# Altium project Ctrl_FOC.PrjPcb
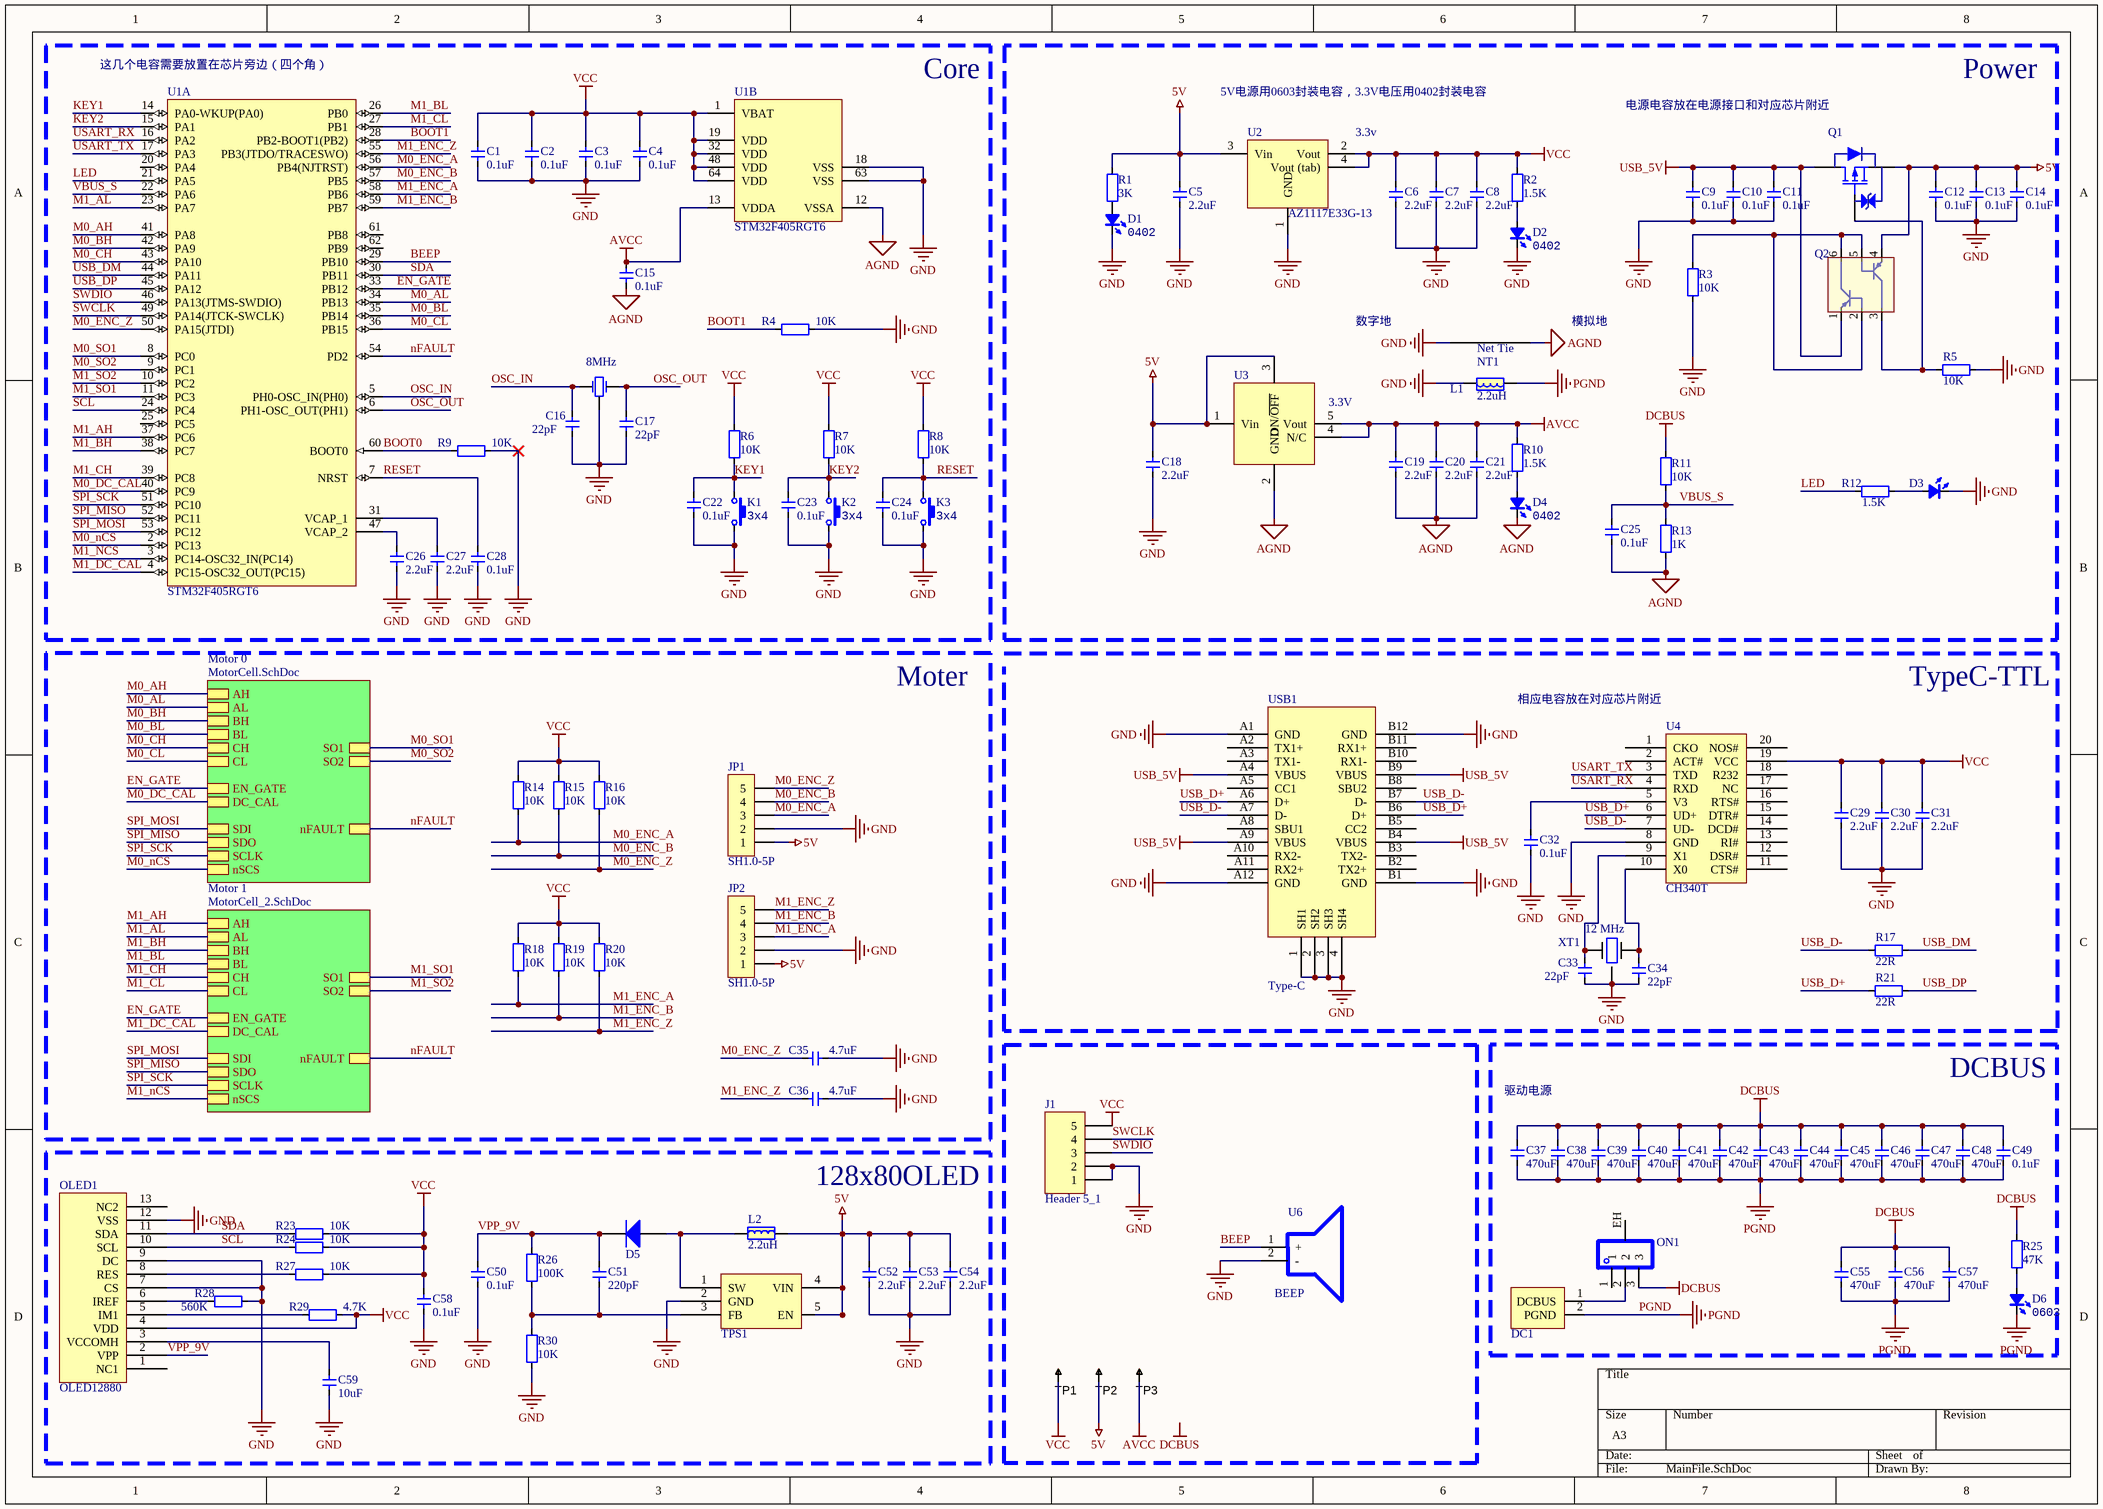
[diagram p0: MainFile.SchDoc]
3 sheets, 209 parts. Net scope: hierarchical (ports join the sheet entries above them; power ports are global).
Board file: Ctrl_FOC.PcbDoc
Sheets:
  MainFile.SchDoc
    Motor 0 = MotorCell.SchDoc
    Motor 1 = MotorCell_2.SchDoc

## Sheet MainFile.SchDoc
size A3

### Parts
C1  0.1uF  [CAP_0402]
C2  0.1uF  [CAP_0402]
C3  0.1uF  [CAP_0402]
C4  0.1uF  [CAP_0402]
C5  2.2uF  [CAP_0603]
C6  2.2uF  [CAP_0402]
C7  2.2uF  [CAP_0402]
C8  2.2uF  [CAP_0402]
C9  0.1uF  [CAP_0603]
C10  0.1uF  [CAP_0603]
C11  0.1uF  [CAP_0603]
C12  0.1uF  [CAP_0603]
C13  0.1uF  [CAP_0603]
C14  0.1uF  [CAP_0603]
C15  0.1uF  [CAP_0603]
C16  22pF  [CAP_0402]
C17  22pF  [CAP_0402]
C18  2.2uF  [CAP_0603]
C19  2.2uF  [CAP_0402]
C20  2.2uF  [CAP_0402]
C21  2.2uF  [CAP_0402]
C22  0.1uF  [CAP_0402]
C23  0.1uF  [CAP_0402]
C24  0.1uF  [CAP_0402]
C25  0.1uF  [CAP_0603]
C26  2.2uF  [CAP_0402]
C27  2.2uF  [CAP_0402]
C28  0.1uF  [CAP_0402]
C29  2.2uF  [CAP_0603]
C30  2.2uF  [CAP_0603]
C31  2.2uF  [CAP_0603]
C32  0.1uF  [CAP_0402]
C33  22pF  [CAP_0402]
C34  22pF  [CAP_0402]
C35  4.7uF  [CAP_0402]
C36  4.7uF  [CAP_0402]
C37  470uF  [CAP_1206]
C38  470uF  [CAP_1206]
C39  470uF  [CAP_1206]
C40  470uF  [CAP_1206]
C41  470uF  [CAP_1206]
C42  470uF  [CAP_1206]
C43  470uF  [CAP_1206]
C44  470uF  [CAP_1206]
C45  470uF  [CAP_1206]
C46  470uF  [CAP_1206]
C47  470uF  [CAP_1206]
C48  470uF  [CAP_1206]
C49  0.1uF  [CAP_1206]
C50  0.1uF  [CAP_0402]
C51  220pF  [CAP_0402]
C52  2.2uF  [CAP_0603]
C53  2.2uF  [CAP_0603]
C54  2.2uF  [CAP_0603]
C55  470uF  [CAP_1206]
C56  470uF  [CAP_1206]
C57  470uF  [CAP_1206]
C58  0.1uF  [CAP_0402]
C59  10uF  [CAP_0402]
D1  Type: 0402  [LED_0402_BLUE]  (hidden comment: color?)
D2  Type: 0402  [LED_0402_BLUE]  (hidden comment: color?)
D3  color?  [LED_0402_BLUE]  (value not drawn)
D4  Type: 0402  [LED_0402_BLUE]  (hidden comment: color?)
D5  二极管-5819W  [SOD-123]  (value not drawn)
D6  Type: 0603  [LED_0603]  (hidden comment: color?)
DC1  电源  [TX60电源]  (value not drawn)
J1  Header 5_1  [单排弯插针5]
JP1  SH1.0-5P  [SH1.0-5P-L]
JP2  SH1.0-5P  [SH1.0-5P-L]
K1  value 3x4  [按键_3x4x2]  (hidden comment: TACT 2P)
K2  value 3x4  [按键_3x4x2]  (hidden comment: TACT 2P)
K3  value 3x4  [按键_3x4x2]  (hidden comment: TACT 2P)
L1  2.2uH  [2520-L]
L2  2.2uH  [2520-L]
NT1  2mm  [NetTie_2mm]  (value not drawn)  (net tie, no BOM)
OLED1  OLED12880  [OLED12880]
ON1  电源开关  [电源开关]  (value not drawn)
Q1  AO3415A  [SOT23-3]  (value not drawn)
Q2  BCM856BS  [SOT363-6]  (value not drawn)
R1  3K  [RES_0603]
R2  1.5K  [RES_0402]
R3  10K  [RES_0603]
R4  10K  [RES_0402]
R5  10K  [RES_0603]
R6  10K  [RES_0402]
R7  10K  [RES_0402]
R8  10K  [RES_0402]
R9  10K  [RES_0402]
R10  1.5K  [RES_0402]
R11  10K  [RES_0603]
R12  1.5K  [RES_0402]
R13  1K  [RES_0603]
R14  10K  [RES_0603]
R15  10K  [RES_0603]
R16  10K  [RES_0603]
R17  22R  [RES_0603]
R18  10K  [RES_0603]
R19  10K  [RES_0603]
R20  10K  [RES_0603]
R21  22R  [RES_0603]
R23  10K  [RES_0402]
R24  10K  [RES_0402]
R25  47K  [RES_0603]
R26  100K  [RES_0402]
R27  10K  [RES_0402]
R28  560K  [RES_0402]
R29  4.7K  [RES_0402]
R30  10K  [RES_0402]
TP1  TESTPOINT  [TP-R30]  (value not drawn)  (no BOM)
TP2  TESTPOINT  [TP-R30]  (value not drawn)  (no BOM)
TP3  TESTPOINT  [TP-R30]  (value not drawn)  (no BOM)
TPS1  TPS61040DBV  [SOT23-5]  (value not drawn)
U1  STM32F405RGT6  [主控芯片LQFP64-10*10]  (parts A,B of 2)
U2  AZ1117E33G-13  value 3.3v  [SOT223]
U3  3.3V  [SOT23-5]
U4  CH340T  [SSOP-20]
U6  BEEP  [BEEP]
USB1  Type-C  [Type-C-TOP]
X1  8MHz  [XTAL3215]
XT1  value 12 MHz  [DFN220P320X110-4N]  (hidden comment: 8 MHz)

### Blocks framed on the sheet
Core: C1-C4 C15-C17 C22-C24 C26-C28 K1-K3 R4 R6-R9 U1 X1
Power: C5-C14 C18-C21 C25 D1-D4 L1 NT1 Q1 Q2 R1-R3 R5 R10-R13 U2 U3
Moter: C35 C36 JP1 JP2 R14-R16 R18-R20
DCBUS: C37-C49 C55-C57 D6 DC1 ON1 R25
128x80OLED: C50-C54 C58 C59 D5 L2 OLED1 R23 R24 R26-R30 TPS1

### Sub-sheets
Motor 0 = MotorCell.SchDoc: nFAULT, EN_GATE, DC_CAL, SDI, SDO, SCLK, nSCS, SO1, SO2, AH, AL, BH, BL, CH, CL
Motor 1 = MotorCell_2.SchDoc: nFAULT, EN_GATE, DC_CAL, SDI, SDO, SCLK, nSCS, SO1, SO2, AH, AL, BH, BL, CH, CL

### Nets
5V: C5.2 C12.2 C13.2 C14.2 C18.2 C52.2 C53.2 C54.2 JP1.1 JP2.1 L2.2 Q1.2(S) Q2.4 R1.2 TP2.1 TPS1.4(VIN) TPS1.5(EN) U2.3(Vin) U3.1(Vin) U3.3(ON/~{OFF})
AGND: C15.1 C19.1 C20.1 C21.1 C25.1 D4.2(K) NT1.2 R13.1 U1.12(VSSA) U3.2(GND)
AVCC: C15.2 C19.2 C20.2 C21.2 R10.2 TP3.1 U1.13(VDDA) U3.4(N/C) U3.5(Vout)
DCBUS: C37.2 C38.2 C39.2 C40.2 C41.2 C42.2 C43.2 C44.2 C45.2 C46.2 C47.2 C48.2 C49.2 C55.2 C56.2 C57.2 ON1.3 R11.2 R25.2
GND: C1.1 C2.1 C3.1 C4.1 C5.1 C6.1 C7.1 C8.1 C9.1 C10.1 C11.1 C12.1 C13.1 C14.1 C16.1 C17.1 C18.1 C22.1 C23.1 C24.1 C26.1 C27.1 C28.2 C29.1 C30.1 C31.1 C32.1 C33.1 C34.1 C35.1 C36.1 C50.1 C52.1 C53.1 C54.1 C58.1 C59.1 D1.2(K) D2.2(K) D3.2(K) J1.1 J1.2 JP1.2 JP2.2 K1.2 K2.2 K3.2 L1.2 NT1.1 OLED1.7(CS) OLED1.9(DC) OLED1.12(VSS) R3.2 R4.1 R5.1 R9.1 R28.2 R30.1 TPS1.2(GND) U1.18(VSS) U1.63(VSS) U2.1(GND) U4.8(GND) U6.2(-) USB1.1(SH1) USB1.2(SH2) USB1.3(SH3) USB1.4(SH4) USB1.A1(GND) USB1.A12(GND) USB1.B1(GND) USB1.B12(GND) X1.2(GND) XT1.G
PGND: C37.1 C38.1 C39.1 C40.1 C41.1 C42.1 C43.1 C44.1 C45.1 C46.1 C47.1 C48.1 C49.1 C55.1 C56.1 C57.1 D6.2(K) DC1.2(PGND) L1.1
USB_5V: C9.2 C10.2 C11.2 Q1.3(D) Q2.1 USB1.A4(VBUS) USB1.A9(VBUS) USB1.B4(VBUS) USB1.B9(VBUS)
VCC: C1.2 C2.2 C3.2 C4.2 C6.2 C7.2 C8.2 C29.2 C30.2 C31.2 C58.2 J1.5 OLED1.4(VDD) R2.2 R6.1 R7.1 R8.1 R14.2 R15.2 R16.2 R18.2 R19.2 R20.2 R23.2 R24.2 R27.2 R29.2 TP1.1 U1.1(VBAT) U1.19(VDD) U1.32(VDD) U1.48(VDD) U1.64(VDD) U2.2(Vout) U2.4(Vout_(tab)) U4.19(VCC)
BEEP: U1.29(PB10) U6.1(+)
BOOT0: R9.2 U1.60(BOOT0)
BOOT1: R4.2 U1.28(PB2-BOOT1(PB2))
EN_GATE: U1.33(PB12) ; sheet Motor 0/EN_GATE, sheet Motor 1/EN_GATE
KEY1: C22.2 K1.1 R6.2 U1.14(PA0-WKUP(PA0))
KEY2: C23.2 K2.1 R7.2 U1.15(PA1)
LED: R12.1 U1.21(PA5)
M0_AH: U1.41(PA8) ; sheet Motor 0/AH
M0_AL: U1.34(PB13) ; sheet Motor 0/AL
M0_BH: U1.42(PA9) ; sheet Motor 0/BH
M0_BL: U1.35(PB14) ; sheet Motor 0/BL
M0_CH: U1.43(PA10) ; sheet Motor 0/CH
M0_CL: U1.36(PB15) ; sheet Motor 0/CL
M0_DC_CAL: U1.40(PC9) ; sheet Motor 0/DC_CAL
M0_ENC_A: JP1.3 R14.1 U1.56(PB4(NJTRST))
M0_ENC_B: JP1.4 R15.1 U1.57(PB5)
M0_ENC_Z: C35.2 JP1.5 R16.1 U1.50(PA15(JTDI))
M0_nCS: U1.2(PC13) ; sheet Motor 0/nSCS
M0_SO1: U1.8(PC0) ; sheet Motor 0/SO1
M0_SO2: U1.9(PC1) ; sheet Motor 0/SO2
M1_AH: U1.37(PC6) ; sheet Motor 1/AH
M1_AL: U1.23(PA7) ; sheet Motor 1/AL
M1_BH: U1.38(PC7) ; sheet Motor 1/BH
M1_BL: U1.26(PB0) ; sheet Motor 1/BL
M1_CH: U1.39(PC8) ; sheet Motor 1/CH
M1_CL: U1.27(PB1) ; sheet Motor 1/CL
M1_DC_CAL: U1.4(PC15-OSC32_OUT(PC15)) ; sheet Motor 1/DC_CAL
M1_ENC_A: JP2.3 R18.1 U1.58(PB6)
M1_ENC_B: JP2.4 R19.1 U1.59(PB7)
M1_ENC_Z: C36.2 JP2.5 R20.1 U1.55(PB3(JTDO/TRACESWO))
M1_nCS: U1.3(PC14-OSC32_IN(PC14)) ; sheet Motor 1/nSCS
M1_SO1: U1.11(PC3) ; sheet Motor 1/SO1
M1_SO2: U1.10(PC2) ; sheet Motor 1/SO2
nFAULT: U1.54(PD2) ; sheet Motor 0/nFAULT, sheet Motor 1/nFAULT
OSC_IN: C16.2 U1.5(PH0-OSC_IN(PH0)) X1.1(OSC1)
OSC_OUT: C17.2 U1.6(PH1-OSC_OUT(PH1)) X1.3(OSC2)
RESET: C24.2 C28.1 K3.1 R8.2 U1.7(NRST)
SCL: OLED1.10(SCL) R24.1 U1.24(PC4)
SDA: OLED1.11(SDA) R23.1 U1.30(PB11)
SPI_MISO: U1.52(PC11) ; sheet Motor 0/SDO, sheet Motor 1/SDO
SPI_MOSI: U1.53(PC12) ; sheet Motor 0/SDI, sheet Motor 1/SDI
SPI_SCK: U1.51(PC10) ; sheet Motor 0/SCLK, sheet Motor 1/SCLK
SWCLK: J1.4 U1.49(PA14(JTCK-SWCLK))
SWDIO: J1.3 U1.46(PA13(JTMS-SWDIO))
USART_RX: U1.16(PA2) U4.4(RXD)
USART_TX: U1.17(PA3) U4.3(TXD)
USB_D+: R21.1 U4.6(UD+) USB1.A6(D+) USB1.B6(D+)
USB_D-: R17.1 U4.7(UD-) USB1.A7(D-) USB1.B7(D-)
USB_DM: R17.2 U1.44(PA11)
USB_DP: R21.2 U1.45(PA12)
VBUS_S: C25.2 R11.1 R13.2 U1.22(PA6)
VPP_9V: C50.2 C51.2 D5.2(K) OLED1.2(VPP) R26.2
NetC26_2: C26.2 U1.47(VCAP_2)
NetC27_2: C27.2 U1.31(VCAP_1)
NetC32_2: C32.2 U4.5(V3)
NetC33_2: C33.2 U4.9(X1) XT1.1
NetC34_2: C34.2 U4.10(X0) XT1.3
NetC51_1: C51.1 R26.1 R30.2 TPS1.3(FB)
NetC59_2: C59.2 OLED1.3(VCCOMH)
NetD1_1: D1.1(A) R1.1
NetD2_1: D2.1(A) R2.1
NetD3_1: D3.1(A) R12.2
NetD4_1: D4.1(A) R10.1
NetD5_1: D5.1(A) L2.1 TPS1.1(SW)
NetD6_1: D6.1(A) R25.1
NetDC1_1: DC1.1(DCBUS) ON1.2
NetOLED1_5: OLED1.5(IM1) R29.1
NetOLED1_6: OLED1.6(IREF) R28.1
NetOLED1_8: OLED1.8(RES) R27.1
NetQ1_1: Q1.1(G) Q2.3 R5.2
NetQ2_2: Q2.2 Q2.5 Q2.6 R3.1

Not connected (* = marked no-connect by the designer): OLED1 1(NC1) 13(NC2); ON1 1 EH; U1 20(PA4) 25(PC5) 61(PB8) 62(PB9); U4 1(CKO) 2(ACT#) 11(CTS#) 12(DSR#) 13(RI#) 14(DCD#) 15(DTR#) 16(RTS#) 17(NC) 18(R232) 20(NOS#); USB1 A2(TX1+) A3(TX1-) A5(CC1) A8(SBU1) A10(RX2-) A11(RX2+) B2(TX2+) B3(TX2-) B5(CC2) B8(SBU2) B10(RX1-) B11(RX1+)

### Notes on the sheet
- (near U1) 这几个电容需要放置在芯片旁边（四个角）
- 5V电源用0603封装电容，3.3V电压用0402封装电容
- 电源电容放在电源接口和对应芯片附近
- 数字地
- 模拟地
- 相应电容放在对应芯片附近
- TypeC-TTL
- 驱动电源
- Labels drawn without touching a wire or pin: DCBUS
- (in symbol NetTie_2mm) Net Tie

### Library data of the parts
C1-C4 C6-C8 C16 C17 C19-C24 C26-C28 C32-C36 C50 C51 C58 C59 = 电容-0402: Capacitor; Value: 0.1u
C5 C9-C15 C18 C25 C29-C31 C52-C54 = 电容-0603: Capacitor; Value: 0.1u
C37-C49 C55-C57 = 电容-1206: Capacitor; Value: 0.1u
D1 D2 D4 = LED_0402: LED; Value: color?
D3 = LED_0402: LED; Type: 0402; Value: color?
D5 = 二极管-5819W: 40V
D6 = LED_0603: LED; Value: color?
DC1 = 电源: 12~24VDC电源
J1 = Header 5_1: Header, 5-Pin; LatestRevisionDate: 17-Jul-2002; LatestRevisionNote: Re-released for DXP Platform.; Publisher: Altium Limited
JP1 JP2 = Header 5: 5P接插件; 厂商: JST; BOM名称: 5P接插件
K1-K3 = ButtonTACT_3x4x2_180: Button; type: TACT 2P
L1 L2 = 电感-0805: 磁珠
NT1 = NetTie_2mm
OLED1 = OLED12880: 12880寸OLED
Q1 = AO3415A: MOSFET; Published: 8-Jun-2000; LatestRevisionDate: 17-Jul-2002; LatestRevisionNote: Re-released for DXP Platform.; PackageVersion: 1995/1996; PackageReference: E3; Publisher: Altium Limited; PackageDescription: TO, Flat Index; 3 In-Line, Axial Leads; Body Dia. 4.6mm; Lead Dia. 0.5 mm (max)
Q2 = BCM856BS: Transistor
R1 R3 R5 R11 R13-R16 R18-R20 R25 = 电阻-0603: Resistor; Value: 22R
R2 R4 R6-R10 R12 R23 R24 R26-R30 = 电阻-0402: Resistor; Value: 22R
R17 R21 = 电阻-0603: Resistor; Value: 22R
TP1-TP3 = TESTPOINT: SMD test pin
U1 = STM32F405RGT6: ARM Cortex-M4 32-bit MCU+FPU, 210 DMIPS, 1024 kB Flash, 192 kB Internal RAM, 51 I/Os, 64-pin LQFP, -40 to 85 degC, Tray; Manufacturer: STMicroelectronics; D/A Converter: 2x12-bit; FLASH Size (Prog) (kB): 1024; I/Os (High Current): 51; Internal RAM Size (kB): 192; Operating Frequency(F) (Processor speed) (MHz): 168; Supply Voltage(Vcc) max (V): 3.6; Supply Voltage(Vcc) min (V): 1.8; DatasheetVersion: Rev. 4; PackageVersion: Rev. 4, 06/2013; PackageReference: LQFP64; PackageDescription: 64-Pin Low Profile Quad Flat Package, 10 x 10 mm Body, 0.5 mm Pitch; Supplier 1: Digi-Key; Supplier Part Number 1: 497-11767-ND; Supplier 2: Farnell; Supplier Part Number 2: 2064363; Supplier 3: Newark; Supplier Part Number 3: 73T2329; Supplier 4: Mouser; Supplier Part Number 4: 511-STM32F405RGT6; Core: ARM Cortex-M4; Packing: Tray; Mounting Technology: Surface Mount; ComponentLink1Description: Manufacturer URL; ComponentLink1URL: http://www.st.com/web/en/home.html; ComponentLink2Description: Datasheet; ComponentLink2URL: http://www.st.com/st-web-ui/static/active/en/resource/technical/document/datasheet/DM00037051.pdf; ComponentLink3Description: Package Specification; ComponentLink3URL: http://www.st.com/st-web-ui/static/active/en/resource/technical/document/datasheet/DM00037051.pdf
U2 = AZ1117E33G-13: IC, LDO, REG, 3.3V, SOT223; Supplier 1: Farnell; Supplier 2: Farnell; Supplier Part Number 1: 1825291RL; Supplier Part Number 2: 1825291
U3 = LP5907MFX-3.3/NOPB: IC REG LDO 3.3V 0.25A SOT23-5; Manufacturer: Texas Instruments; Regulator Topology: Positive Fixed; Current - Output: 250mA; Voltage - Input: Up to 5.5V; Supplier 1: Digi-Key; Supplier Part Number 1: 296-38557-1-ND; RoHS: RoHS Compliant; Category: Integrated Circuits (ICs); Stock 1: 39845; Pricing 1: 1=0.57, 10=0.487, 100=0.3634, 500=0.28552, 1000=0.22063 (USD); Packaging: Cut Tape (CT); Part Status: Active; Voltage - Output: 3.3V; Voltage - Dropout (Typical): -; Current - Limit (Min): -; Operating Temperature: -40°C ~ 125°C; Mounting Type: Surface Mount; Package / Case: SC-74A, SOT-753; Supplier Device Package: SOT-23; ComponentLink1URL: http://www.ti.com/lit/ds/symlink/lp5907.pdf; ComponentLink1Description: http://www.ti.com/lit/ds/symlink/lp5907.pdf
U4 = CH340T: Port
USB1 = USB-Type-C-TOP
X1 = XTAL-3215
XT1 = ABM3B-8.000MHZ-10-1-U-T: Crystal 8MHz ±10ppm 10pF 200 Ohm -10°C ~ 60°C Surface Mount 4-SMD, No Lead (DFN, LCC); Manufacturer: Abracon LLC; Operating Mode: Fundamental; Supplier 1: Digi-Key; Supplier Part Number 1: 535-9721-1-ND; RoHS: RoHS Compliant; Category: Crystals, Oscillators, Resonators; Stock: 35437; Pricing 1: 1=0.69, 10=0.578, 50=0.5198, 100=0.462, 500=0.4389 (USD); Packaging: Cut Tape (CT); Part Status: Active; Type: MHz Crystal; Frequency Stability: ±10ppm; Frequency Tolerance: ±10ppm; Load Capacitance: 10pF; Operating Temperature: -10°C ~ 60°C; Ratings: -; Mounting Type: Surface Mount; Package / Case: 4-SMD, No Lead; Size / Dimension: 0.197" L x 0.126" W (5.00mm x 3.20mm); Height - Seated (Max): 0.043" (1.10mm); ComponentLink1URL: http://www.abracon.com/Resonators/abm3b.pdf; ComponentLink1Description: http://www.abracon.com/Resonators/abm3b.pdf; Supplier 2: Digi-Key; Supplier Part Number 2: 535-9721-2-ND; Pricing 2: 1000=0.336, 3000=0.315, 5000=0.3045, 10000=0.294 (USD); Manufacturer Part Number: ABM3B-8.000MHZ-10-1-U-T

## Sheet MotorCell.SchDoc
size A3
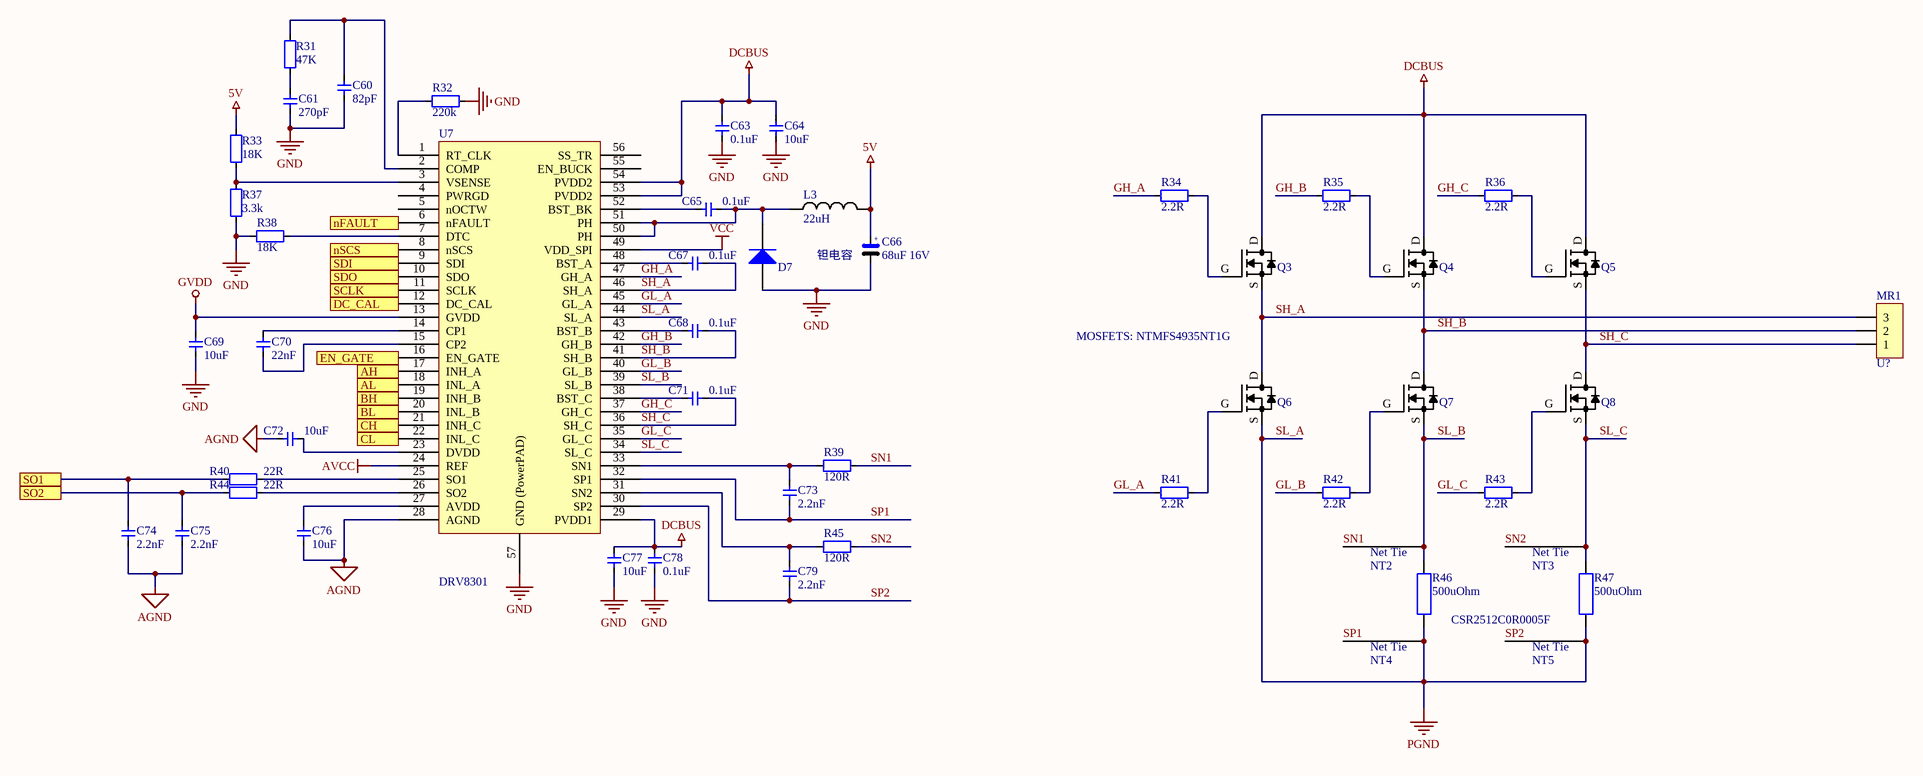
[diagram p1: MotorCell.SchDoc]

### Parts
C60  82pF  [CAP_0402]
C61  270pF  [CAP_0402]
C63  0.1uF  [CAP_0603]
C64  10uF  [CAP_0603]
C65  0.1uF  [CAP_0402]
C66  68uF 16V  [CAPCP6032X28N]
C67  0.1uF  [CAP_0603]
C68  0.1uF  [CAP_0603]
C69  10uF  [CAP_0402]
C70  22nF  [CAP_0402]
C71  0.1uF  [CAP_0603]
C72  10uF  [CAP_0402]
C73  2.2nF  [CAP_0402]
C74  2.2nF  [CAP_0402]
C75  2.2nF  [CAP_0402]
C76  10uF  [CAP_0402]
C77  10uF  [CAP_0603]
C78  0.1uF  [CAP_0603]
C79  2.2nF  [CAP_0402]
D7  MBR140SFT1G  [DIOM2717X10N]  (value not drawn)
L3  22uH  [INDC6060X28N]
MR1  U?  [MR30PW-M]
NT2  0.25mm  [NetTie_0.25mm]  (value not drawn)  (net tie, no BOM)
NT3  0.25mm  [NetTie_0.25mm]  (value not drawn)  (net tie, no BOM)
NT4  0.25mm  [NetTie_0.25mm]  (value not drawn)  (net tie, no BOM)
NT5  0.25mm  [NetTie_0.25mm]  (value not drawn)  (net tie, no BOM)
Q3  NTMFS4935NT1G  [SO8FL]  (value not drawn)
Q4  NTMFS4935NT1G  [SO8FL]  (value not drawn)
Q5  NTMFS4935NT1G  [SO8FL]  (value not drawn)
Q6  NTMFS4935NT1G  [SO8FL]  (value not drawn)
Q7  NTMFS4935NT1G  [SO8FL]  (value not drawn)
Q8  NTMFS4935NT1G  [SO8FL]  (value not drawn)
R31  47K  [RES_0402]
R32  220k  [RES_0402]
R33  18K  [RES_0402]
R34  2.2R  [RES_0402]
R35  2.2R  [RES_0402]
R36  2.2R  [RES_0402]
R37  3.3k  [RES_0402]
R38  18K  [RES_0402]
R39  120R  [RES_0402]
R40  22R  [RES_0402]
R41  2.2R  [RES_0402]
R42  2.2R  [RES_0402]
R43  2.2R  [RES_0402]
R44  22R  [RES_0402]
R45  120R  [RES_0402]
R46  value 500uOhm  [RESC6432X09N]  (hidden comment: CSR2512C0R0005F)
R47  value 500uOhm  [RESC6432X09N]  (hidden comment: CSR2512C0R0005F)
U7  DRV8301  [TSSOP50P810X120_HS-57N]

### Ports
AH, AL, BH, BL, CH, CL, DC_CAL, EN_GATE, nFAULT, nSCS, SCLK, SDI, SDO, SO1, SO2

### Nets
5V: C66.1 L3.2 R33.2
AGND: C72.2 C74.1 C75.1 C76.1 U7.28(AGND)
AVCC: U7.24(REF)
DCBUS: C63.2 C64.2 C77.2 C78.2 Q3.D Q4.D Q5.D U7.29(PVDD1) U7.53(PVDD2) U7.54(PVDD2)
GND: C60.2 C61.2 C63.1 C64.1 C66.2 C69.1 C77.1 C78.1 D7.A R32.1 R37.1 R38.1 U7.57(GND_(PowerPAD))
GVDD: C69.2 U7.13(GVDD)
PGND: NT4.2 NT5.2 Q6.S R46.1 R47.1 U7.44(SL_A)  [also labelled SL_A]
VCC: U7.49(VDD_SPI)
EN_GATE: U7.16(EN_GATE) ; port EN_GATE
GH_A: R34.1 U7.47(GH_A)
GH_B: R35.1 U7.42(GH_B)
GH_C: R36.1 U7.37(GH_C)
GL_A: R41.1 U7.45(GL_A)
GL_B: R42.1 U7.40(GL_B)
GL_C: R43.1 U7.35(GL_C)
M0_AH: U7.17(INH_A) ; port AH
M0_AL: U7.18(INL_A) ; port AL
M0_BH: U7.19(INH_B) ; port BH
M0_BL: U7.20(INL_B) ; port BL
M0_CH: U7.21(INH_C) ; port CH
M0_CL: U7.22(INL_C) ; port CL
M0_DC_CAL: U7.12(DC_CAL) ; port DC_CAL
M0_nCS: U7.8(nSCS) ; port nSCS
M0_SO1: C74.2 R40.1 ; port SO1
M0_SO2: C75.2 R44.1 ; port SO2
nFAULT: U7.6(nFAULT) ; port nFAULT
SH_A: C67.2 MR1.3 Q3.S Q6.D U7.46(SH_A)
SH_B: C68.2 MR1.2 Q4.S Q7.D U7.41(SH_B)
SH_C: C71.2 MR1.1 Q5.S Q8.D U7.36(SH_C)
SL_B: NT2.2 Q7.S R46.2 U7.39(SL_B)
SL_C: NT3.2 Q8.S R47.2 U7.34(SL_C)
SN1: NT2.1 R39.2
SN2: NT3.1 R45.2
SP1: C73.1 NT4.1 U7.32(SP1)
SP2: C79.1 NT5.1 U7.30(SP2)
SPI_MISO: U7.10(SDO) ; port SDO
SPI_MOSI: U7.9(SDI) ; port SDI
SPI_SCK: U7.11(SCLK) ; port SCLK
NetC60_1: C60.1 R31.2 U7.2(COMP)
NetC61_1: C61.1 R31.1
NetC65_1: C65.1 D7.K L3.1 U7.50(PH) U7.51(PH)
NetC65_2: C65.2 U7.52(BST_BK)
NetC67_1: C67.1 U7.48(BST_A)
NetC68_1: C68.1 U7.43(BST_B)
NetC70_1: C70.1 U7.14(CP1)
NetC70_2: C70.2 U7.15(CP2)
NetC71_1: C71.1 U7.38(BST_C)
NetC72_1: C72.1 U7.23(DVDD)
NetC73_2: C73.2 R39.1 U7.33(SN1)
NetC76_2: C76.2 U7.27(AVDD)
NetC79_2: C79.2 R45.1 U7.31(SN2)
NetQ3_G: Q3.G R34.2
NetQ4_G: Q4.G R35.2
NetQ5_G: Q5.G R36.2
NetQ6_G: Q6.G R41.2
NetQ7_G: Q7.G R42.2
NetQ8_G: Q8.G R43.2
NetR32_2: R32.2 U7.1(RT_CLK)
NetR33_1: R33.1 R37.2 U7.3(VSENSE)
NetR38_2: R38.2 U7.7(DTC)
NetR40_2: R40.2 U7.25(SO1)
NetR44_2: R44.2 U7.26(SO2)

Not connected (* = marked no-connect by the designer): U7 4(PWRGD) 5(nOCTW) 55(EN_BUCK) 56(SS_TR)

### Notes on the sheet
- 钽电容
- MOSFETS: NTMFS4935NT1G
- (near NT5) CSR2512C0R0005F
- (in symbol NetTie_0.25mm) Net Tie
- (in symbol 钽电容) +

### Library data of the parts
C60 C61 C65 C69 C70 C72-C76 C79 = 电容-0402: Capacitor; Value: 0.1u
C63 C64 C67 C68 C71 C77 C78 = 电容-0603: Capacitor; Value: 0.1u
C66 = 钽电容
D7 = MBR140SFT1G: Rectifier Diode, Single, 40 V, 1 A, SOD-123FL, 2, 550 mV
L3 = NR6028T220M: INDUCTOR 22UH 1.4A 175.5 MOHM; Value: 22uH
MR1 = MR30PW-M: MR30PW-M 三芯
NT2-NT5 = NetTie_0.25mm
Q3-Q8 = NTMFS4935NT1G: MOSFET N-CH 30V 13A SO8FL; Manufacturer: ON Semiconductor; FET Type: N-Channel; Current - Continuous Drain (Id) @ 25°C: 13A (Ta), 93A (Tc); Drive Voltage (Max Rds On,  Min Rds On): 4.5V, 10V; Vgs(th) (Max) @ Id: 2.2V @ 250µA; Gate Charge (Qg) (Max) @ Vgs: 49.4nC @ 10V; Input Capacitance (Ciss) (Max) @ Vds: 4850pF @ 15V; Vgs (Max): ±20V; Power Dissipation (Max): 930mW (Ta), 48W (Tc); Rds On (Max) @ Id, Vgs: 3.2 mOhm @ 30A, 10V; Supplier 1: Digi-Key; Supplier Part Number 1: NTMFS4935NT1GOSCT-ND; RoHS: RoHS Compliant; Category: Discrete Semiconductor Products; Stock 1: 932; Pricing 1: 1=0.61, 10=0.541, 100=0.4145, 500=0.3277 (USD); Packaging: Cut Tape (CT); Part Status: Active; Technology: MOSFET (Metal Oxide); Drain to Source Voltage (Vdss): 30V; FET Feature: -; Operating Temperature: -55°C ~ 150°C (TJ); Mounting Type: Surface Mount; Supplier Device Package: 5-DFN (5x6) (8-SOFL); Package / Case: 8-PowerTDFN, 5 Leads; ComponentLink1URL: http://www.onsemi.com/pub_link/Collateral/NTMFS4935N-D.PDF; ComponentLink1Description: http://www.onsemi.com/pub_link/Collateral/NTMFS4935N-D.PDF; Manufacturer Part Number: NTMFS4935NT1G
R31-R39 R41-R43 R45 = 电阻-0402: Resistor; Value: 22R
R40 R44 = 电阻-0402: Resistor; Value: 22R
R46 R47 = CSR2512C0R0005F: RES SMD 0.0005 OHM 1% 3W 2512; Manufacturer: Riedon; Temperature Coefficient: ±100ppm/°C; Supplier 1: Digi-Key; Supplier Part Number 1: 696-1183-2-ND; RoHS: RoHS Compliant; Category: Resistors; Stock: 2000; Pricing 1: 2000=0.19817, 6000=0.1937, 10000=0.187, 50000=0.18148 (USD); Packaging: Tape & Reel (TR); Part Status: Active; Tolerance: ±1%; Power (Watts): 3W; Composition: Metal Element; Features: Current Sense; Operating Temperature: -55°C ~ 170°C; Package / Case: 2512 (6432 Metric); Supplier Device Package: 2512; Size / Dimension: 0.250" L x 0.118" W (6.35mm x 3.00mm); Height - Seated (Max): 0.057" (1.45mm); Failure Rate: -; ComponentLink1URL: http://riedon.com/media/pdf/CSR.pdf; ComponentLink1Description: http://riedon.com/media/pdf/CSR.pdf; Supplier 2: Digi-Key; Supplier Part Number 2: 696-1183-1-ND; Pricing 2: 1=0.69, 10=0.574, 25=0.4916, 50=0.4426, 100=0.3852, 250=0.3442, 500=0.27864, 1000=0.22536 (USD); Manufacturer Part Number: CSR2512C0R0005F
U7 = DRV8301: MOTOR DRIVER, 3PH, 56HTSSOP

## Sheet MotorCell_2.SchDoc
size A3
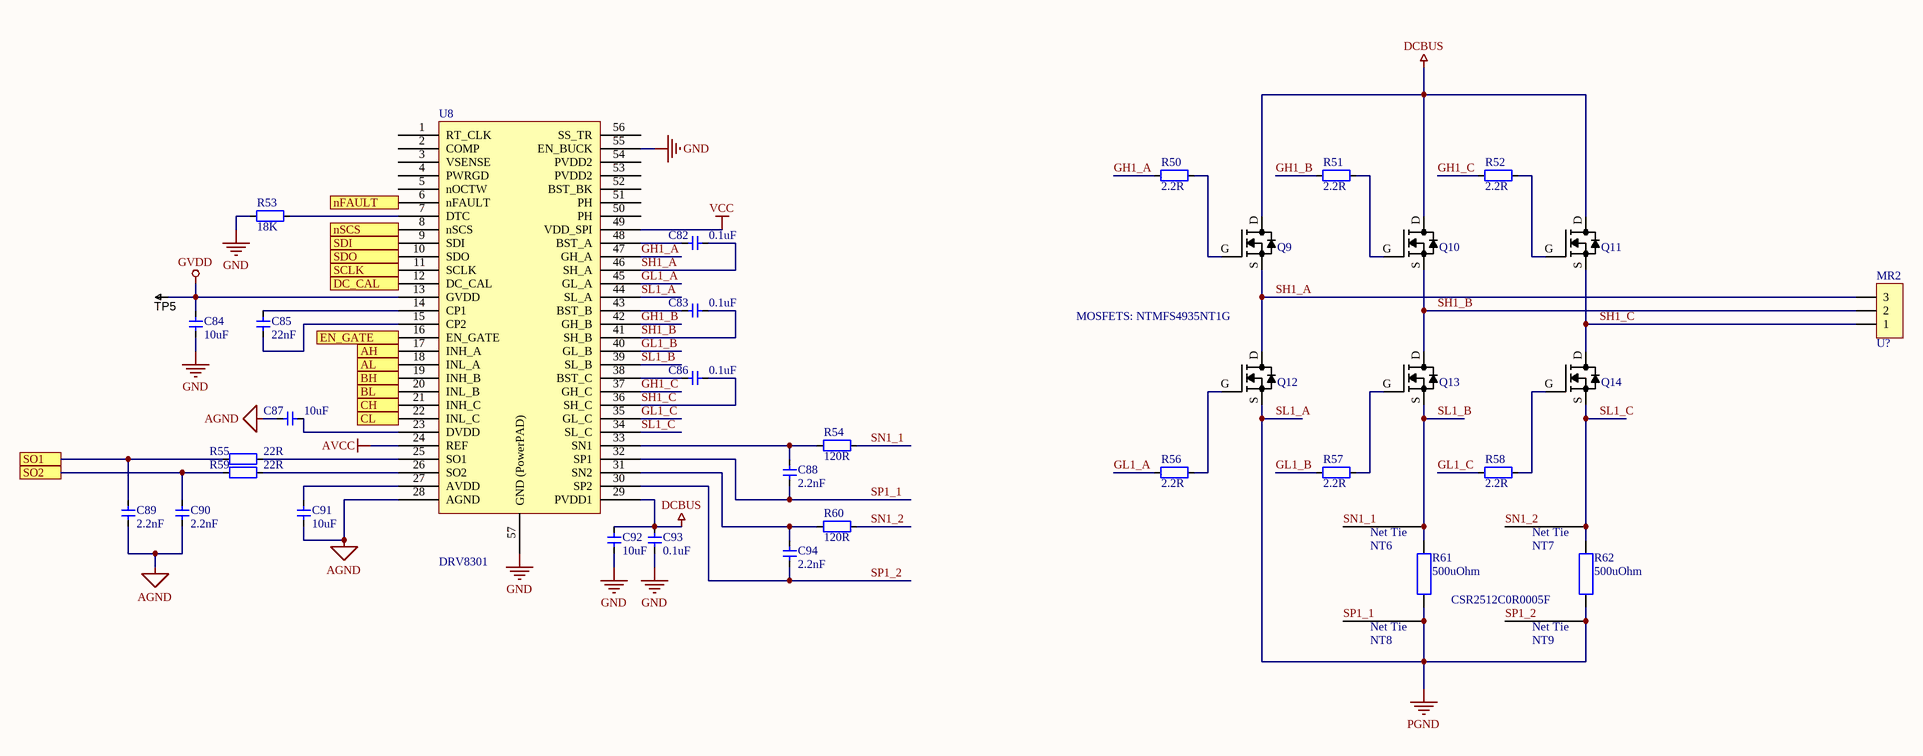
[diagram p2: MotorCell_2.SchDoc]

### Parts
C82  0.1uF  [CAP_0603]
C83  0.1uF  [CAP_0603]
C84  10uF  [CAP_0402]
C85  22nF  [CAP_0402]
C86  0.1uF  [CAP_0603]
C87  10uF  [CAP_0402]
C88  2.2nF  [CAP_0402]
C89  2.2nF  [CAP_0402]
C90  2.2nF  [CAP_0402]
C91  10uF  [CAP_0402]
C92  10uF  [CAP_0603]
C93  0.1uF  [CAP_0603]
C94  2.2nF  [CAP_0402]
MR2  U?  [MR30PW-M]
NT6  0.25mm  [NetTie_0.25mm]  (value not drawn)  (net tie, no BOM)
NT7  0.25mm  [NetTie_0.25mm]  (value not drawn)  (net tie, no BOM)
NT8  0.25mm  [NetTie_0.25mm]  (value not drawn)  (net tie, no BOM)
NT9  0.25mm  [NetTie_0.25mm]  (value not drawn)  (net tie, no BOM)
Q9  NTMFS4935NT1G  [SO8FL]  (value not drawn)
Q10  NTMFS4935NT1G  [SO8FL]  (value not drawn)
Q11  NTMFS4935NT1G  [SO8FL]  (value not drawn)
Q12  NTMFS4935NT1G  [SO8FL]  (value not drawn)
Q13  NTMFS4935NT1G  [SO8FL]  (value not drawn)
Q14  NTMFS4935NT1G  [SO8FL]  (value not drawn)
R50  2.2R  [RES_0402]
R51  2.2R  [RES_0402]
R52  2.2R  [RES_0402]
R53  18K  [RES_0402]
R54  120R  [RES_0402]
R55  22R  [RES_0402]
R56  2.2R  [RES_0402]
R57  2.2R  [RES_0402]
R58  2.2R  [RES_0402]
R59  22R  [RES_0402]
R60  120R  [RES_0402]
R61  value 500uOhm  [RESC6432X09N]  (hidden comment: CSR2512C0R0005F)
R62  value 500uOhm  [RESC6432X09N]  (hidden comment: CSR2512C0R0005F)
TP5  TESTPOINT  [TP-R30]  (value not drawn)  (no BOM)
U8  DRV8301  [TSSOP50P810X120_HS-57N]

### Ports
AH, AL, BH, BL, CH, CL, DC_CAL, EN_GATE, nFAULT, nSCS, SCLK, SDI, SDO, SO1, SO2

### Nets
AGND: C87.2 C89.1 C90.1 C91.1 U8.28(AGND)
AVCC: U8.24(REF)
DCBUS: C92.2 C93.2 Q9.D Q10.D Q11.D U8.29(PVDD1)
GND: C84.1 C92.1 C93.1 R53.1 U8.55(EN_BUCK) U8.57(GND_(PowerPAD))
GVDD: C84.2 TP5.1 U8.13(GVDD)
PGND: NT8.2 NT9.2 Q12.S R61.1 R62.1 U8.44(SL_A)  [also labelled SL1_A]
VCC: U8.49(VDD_SPI)
EN_GATE: U8.16(EN_GATE) ; port EN_GATE
GH1_A: R50.1 U8.47(GH_A)
GH1_B: R51.1 U8.42(GH_B)
GH1_C: R52.1 U8.37(GH_C)
GL1_A: R56.1 U8.45(GL_A)
GL1_B: R57.1 U8.40(GL_B)
GL1_C: R58.1 U8.35(GL_C)
M1_AH: U8.17(INH_A) ; port AH
M1_AL: U8.18(INL_A) ; port AL
M1_BH: U8.19(INH_B) ; port BH
M1_BL: U8.20(INL_B) ; port BL
M1_CH: U8.21(INH_C) ; port CH
M1_CL: U8.22(INL_C) ; port CL
M1_DC_CAL: U8.12(DC_CAL) ; port DC_CAL
M1_nCS: U8.8(nSCS) ; port nSCS
M1_SO1: C89.2 R55.1 ; port SO1
M1_SO2: C90.2 R59.1 ; port SO2
nFAULT: U8.6(nFAULT) ; port nFAULT
SH1_A: C82.2 MR2.3 Q9.S Q12.D U8.46(SH_A)
SH1_B: C83.2 MR2.2 Q10.S Q13.D U8.41(SH_B)
SH1_C: C86.2 MR2.1 Q11.S Q14.D U8.36(SH_C)
SL1_B: NT6.2 Q13.S R61.2 U8.39(SL_B)
SL1_C: NT7.2 Q14.S R62.2 U8.34(SL_C)
SN1_1: NT6.1 R54.2
SN1_2: NT7.1 R60.2
SP1_1: C88.1 NT8.1 U8.32(SP1)
SP1_2: C94.1 NT9.1 U8.30(SP2)
SPI_MISO: U8.10(SDO) ; port SDO
SPI_MOSI: U8.9(SDI) ; port SDI
SPI_SCK: U8.11(SCLK) ; port SCLK
NetC82_1: C82.1 U8.48(BST_A)
NetC83_1: C83.1 U8.43(BST_B)
NetC85_1: C85.1 U8.14(CP1)
NetC85_2: C85.2 U8.15(CP2)
NetC86_1: C86.1 U8.38(BST_C)
NetC87_1: C87.1 U8.23(DVDD)
NetC88_2: C88.2 R54.1 U8.33(SN1)
NetC91_2: C91.2 U8.27(AVDD)
NetC94_2: C94.2 R60.1 U8.31(SN2)
NetQ9_G: Q9.G R50.2
NetQ10_G: Q10.G R51.2
NetQ11_G: Q11.G R52.2
NetQ12_G: Q12.G R56.2
NetQ13_G: Q13.G R57.2
NetQ14_G: Q14.G R58.2
NetR53_2: R53.2 U8.7(DTC)
NetR55_2: R55.2 U8.25(SO1)
NetR59_2: R59.2 U8.26(SO2)

Not connected (* = marked no-connect by the designer): U8 1(RT_CLK) 2(COMP) 3(VSENSE) 4(PWRGD) 5(nOCTW) 50(PH) 51(PH) 52(BST_BK) 53(PVDD2) 54(PVDD2) 56(SS_TR)

### Notes on the sheet
- MOSFETS: NTMFS4935NT1G
- (near NT9) CSR2512C0R0005F
- (in symbol NetTie_0.25mm) Net Tie

### Library data of the parts
C82 C83 C86 C92 C93 = 电容-0603: Capacitor; Value: 0.1u
C84 C85 C87-C91 C94 = 电容-0402: Capacitor; Value: 0.1u
MR2 = MR30PW-M: MR30PW-M 三芯
NT6-NT9 = NetTie_0.25mm
Q9-Q14 = NTMFS4935NT1G: as Q3 on sheet MotorCell; Supplier 1: Digi-Key; Supplier Part Number 1: NTMFS4935NT1GOSCT-ND; RoHS: RoHS Compliant; Category: Discrete Semiconductor Products; Stock 1: 932; Pricing 1: 1=0.61, 10=0.541, 100=0.4145, 500=0.3277 (USD); Packaging: Cut Tape (CT); Part Status: Active; Technology: MOSFET (Metal Oxide); Drain to Source Voltage (Vdss): 30V; FET Feature: -; Operating Temperature: -55°C ~ 150°C (TJ); Mounting Type: Surface Mount; Supplier Device Package: 5-DFN (5x6) (8-SOFL); Package / Case: 8-PowerTDFN, 5 Leads; ComponentLink1URL: http://www.onsemi.com/pub_link/Collateral/NTMFS4935N-D.PDF; ComponentLink1Description: http://www.onsemi.com/pub_link/Collateral/NTMFS4935N-D.PDF; Manufacturer Part Number: NTMFS4935NT1G
R50-R54 R56-R58 R60 = 电阻-0402: Resistor; Value: 22R
R55 R59 = 电阻-0402: Resistor; Value: 22R
R61 R62 = CSR2512C0R0005F: as R46 on sheet MotorCell; Supplier 1: Digi-Key; Supplier Part Number 1: 696-1183-2-ND; RoHS: RoHS Compliant; Category: Resistors; Stock: 2000; Pricing 1: 2000=0.19817, 6000=0.1937, 10000=0.187, 50000=0.18148 (USD); Packaging: Tape & Reel (TR); Part Status: Active; Tolerance: ±1%; Power (Watts): 3W; Composition: Metal Element; Features: Current Sense; Operating Temperature: -55°C ~ 170°C; Package / Case: 2512 (6432 Metric); Supplier Device Package: 2512; Size / Dimension: 0.250" L x 0.118" W (6.35mm x 3.00mm); Height - Seated (Max): 0.057" (1.45mm); Failure Rate: -; ComponentLink1URL: http://riedon.com/media/pdf/CSR.pdf; ComponentLink1Description: http://riedon.com/media/pdf/CSR.pdf; Supplier 2: Digi-Key; Supplier Part Number 2: 696-1183-1-ND; Pricing 2: 1=0.69, 10=0.574, 25=0.4916, 50=0.4426, 100=0.3852, 250=0.3442, 500=0.27864, 1000=0.22536 (USD); Manufacturer Part Number: CSR2512C0R0005F
TP5 = TESTPOINT: SMD test pin
U8 = DRV8301: MOTOR DRIVER, 3PH, 56HTSSOP

## Nets that join several sheets
5V: MainFile (20 pins), MotorCell (C66.1 L3.2 R33.2)
AGND: MainFile (10 pins), MotorCell (5 pins), MotorCell_2 (5 pins)
AVCC: MainFile (9 pins), MotorCell (U7.24), MotorCell_2 (U8.24)
DCBUS: MainFile (19 pins), MotorCell (10 pins), MotorCell_2 (6 pins)
GND: MainFile (74 pins), MotorCell (13 pins), MotorCell_2 (6 pins)
GVDD: MotorCell (C69.2 U7.13), MotorCell_2 (C84.2 TP5.1 U8.13)
PGND: MainFile (19 pins), MotorCell (6 pins), MotorCell_2 (6 pins)
VCC: MainFile (36 pins), MotorCell (U7.49), MotorCell_2 (U8.49)
EN_GATE: MainFile (U1.33), MotorCell (U7.16), MotorCell_2 (U8.16)
M0_AH: MainFile (U1.41), MotorCell (U7.17)
M0_AL: MainFile (U1.34), MotorCell (U7.18)
M0_BH: MainFile (U1.42), MotorCell (U7.19)
M0_BL: MainFile (U1.35), MotorCell (U7.20)
M0_CH: MainFile (U1.43), MotorCell (U7.21)
M0_CL: MainFile (U1.36), MotorCell (U7.22)
M0_DC_CAL: MainFile (U1.40), MotorCell (U7.12)
M0_nCS: MainFile (U1.2), MotorCell (U7.8)
M0_SO1: MainFile (U1.8), MotorCell (C74.2 R40.1)
M0_SO2: MainFile (U1.9), MotorCell (C75.2 R44.1)
M1_AH: MainFile (U1.37), MotorCell_2 (U8.17)
M1_AL: MainFile (U1.23), MotorCell_2 (U8.18)
M1_BH: MainFile (U1.38), MotorCell_2 (U8.19)
M1_BL: MainFile (U1.26), MotorCell_2 (U8.20)
M1_CH: MainFile (U1.39), MotorCell_2 (U8.21)
M1_CL: MainFile (U1.27), MotorCell_2 (U8.22)
M1_DC_CAL: MainFile (U1.4), MotorCell_2 (U8.12)
M1_nCS: MainFile (U1.3), MotorCell_2 (U8.8)
M1_SO1: MainFile (U1.11), MotorCell_2 (C89.2 R55.1)
M1_SO2: MainFile (U1.10), MotorCell_2 (C90.2 R59.1)
nFAULT: MainFile (U1.54), MotorCell (U7.6), MotorCell_2 (U8.6)
SPI_MISO: MainFile (U1.52), MotorCell (U7.10), MotorCell_2 (U8.10)
SPI_MOSI: MainFile (U1.53), MotorCell (U7.9), MotorCell_2 (U8.9)
SPI_SCK: MainFile (U1.51), MotorCell (U7.11), MotorCell_2 (U8.11)